# Altium project FPGA扩展板01.PrjPcb
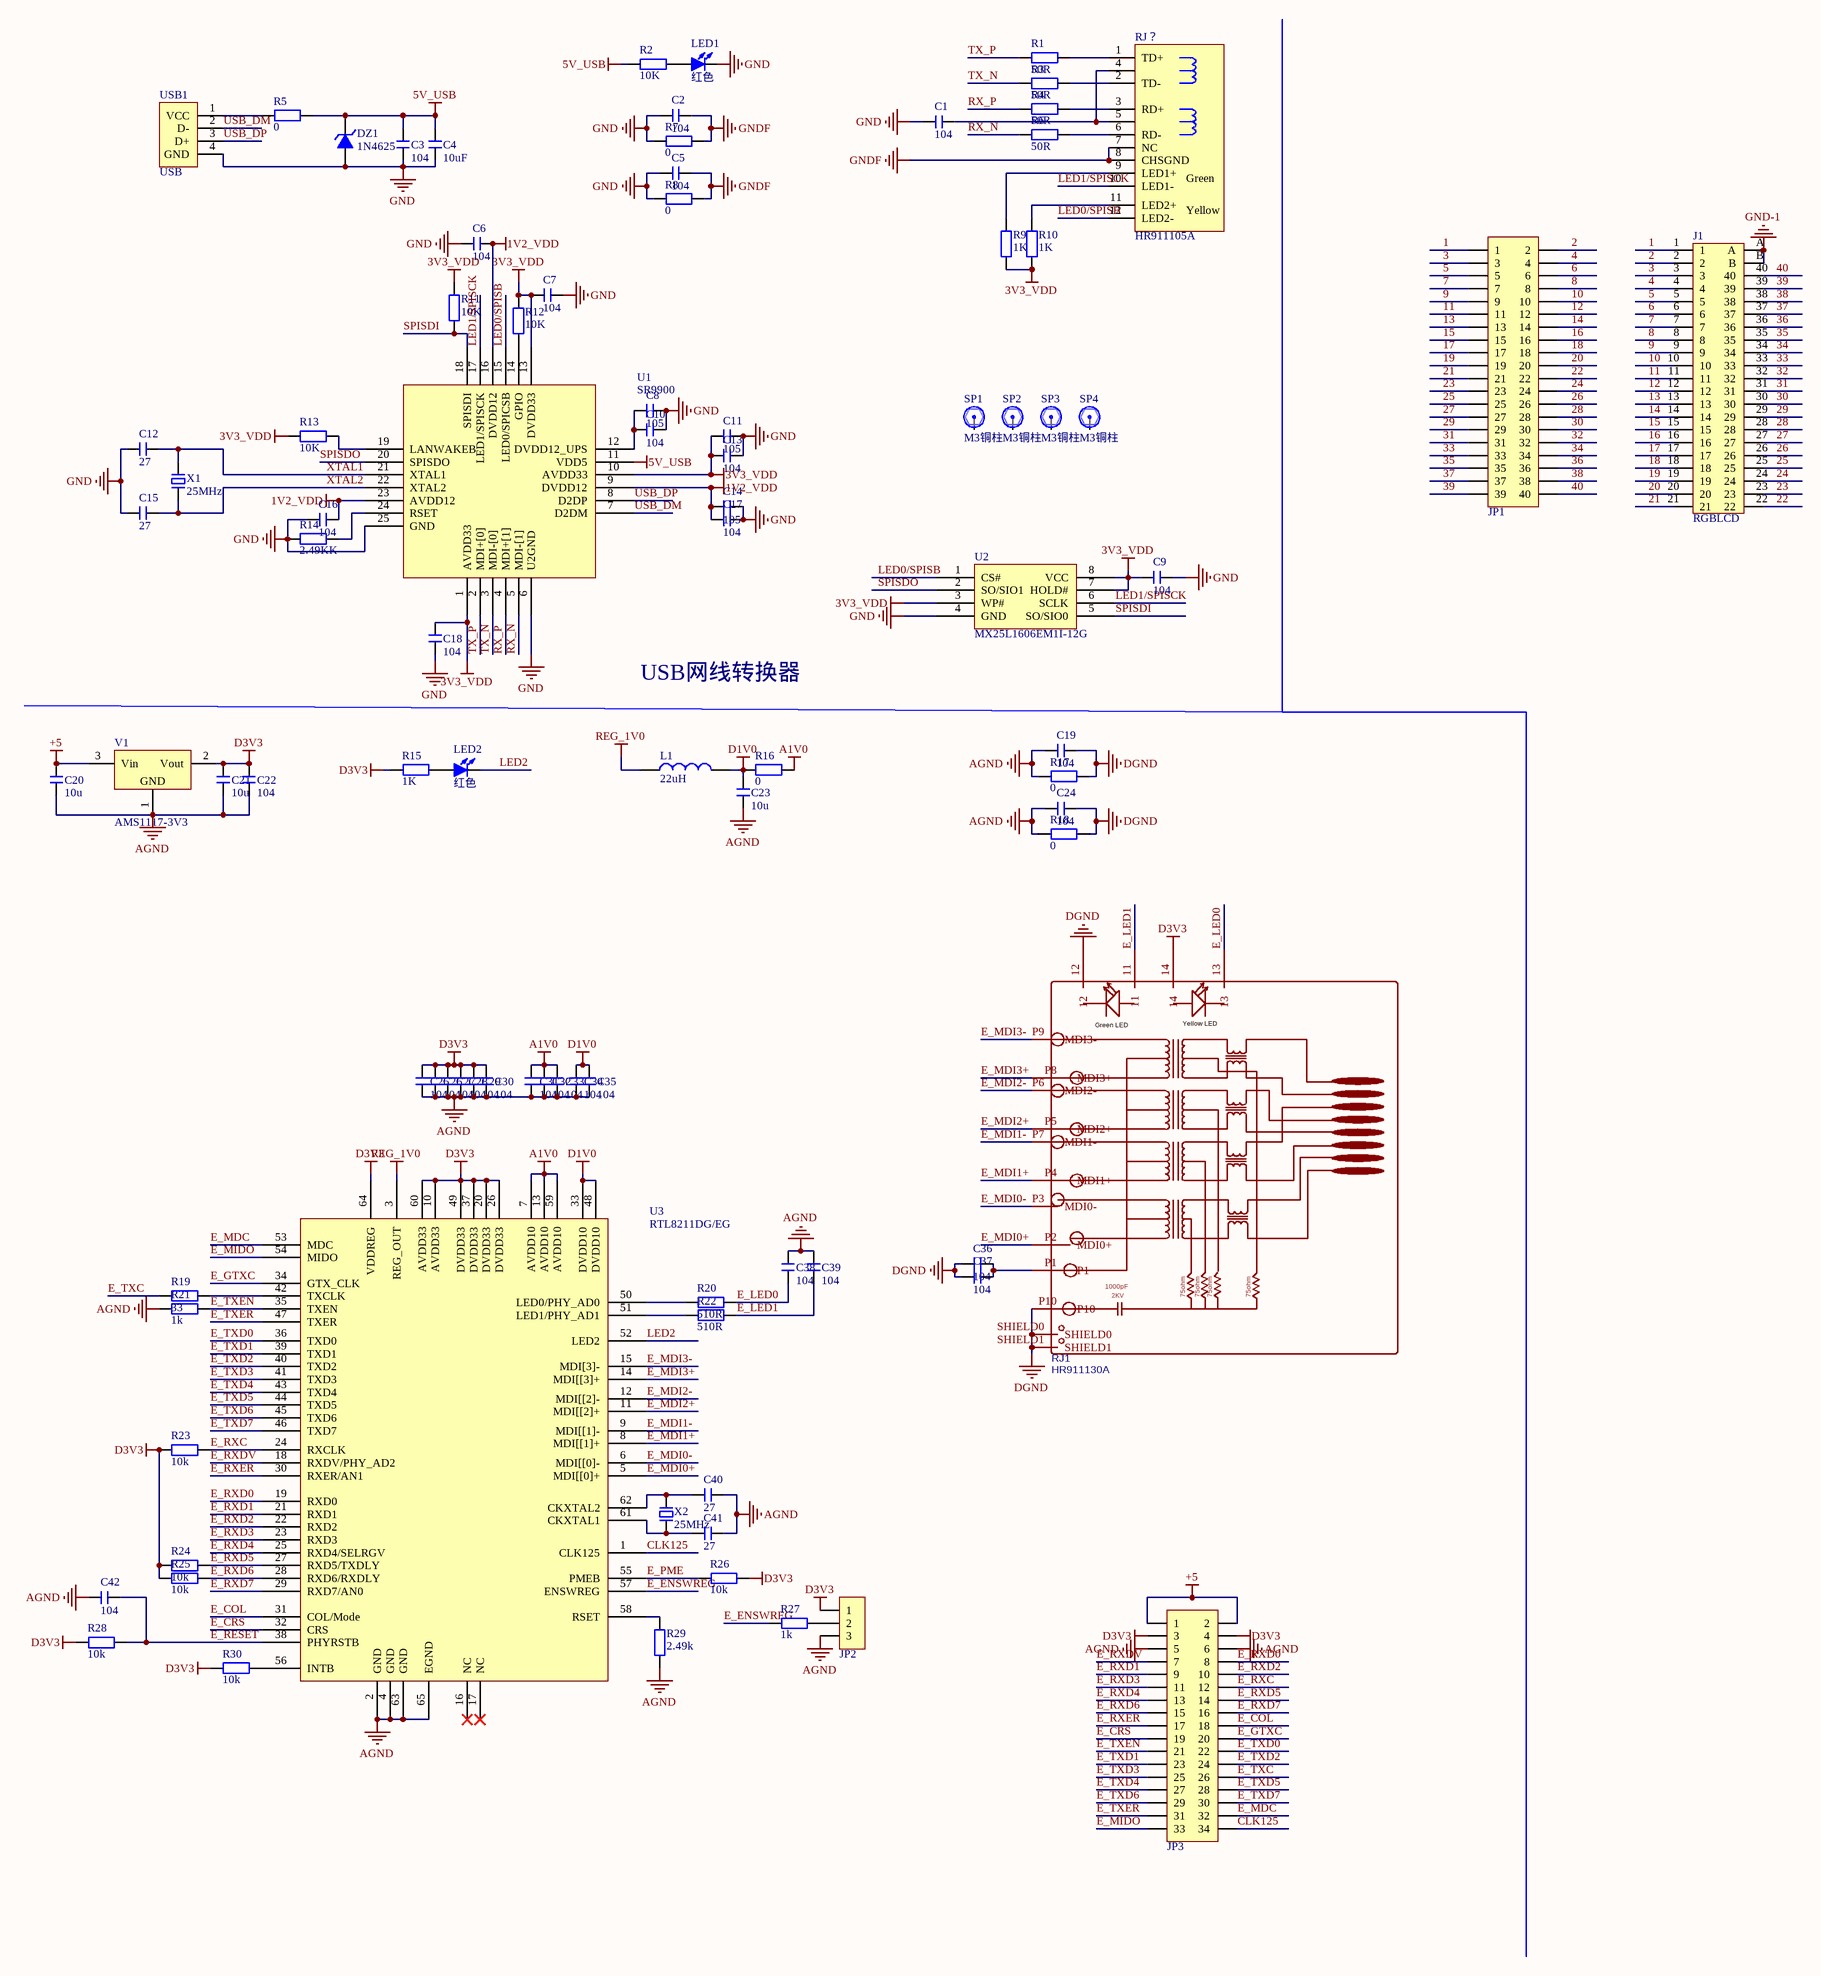
[diagram p0: FPGA扩展板01.SchDoc]
1 sheet, 93 parts. Net scope: global (net labels, ports and power ports of the same name join across sheets).
Board file: FPGA扩展板01.PcbDoc

## Sheet FPGA扩展板01.SchDoc
size A2

### Parts
C1  104  [C 0805_L]
C2  104  [C 0805_L]
C3  104  [C 0805_L]
C4  10uF  [C 0805_L]
C5  104  [C 0805_L]
C6  104  [C 0805_L]
C7  104  [C 0805_L]
C8  105  [C 0805_L]
C9  104  [C 0805_L]
C10  104  [C 0805_L]
C11  105  [C 0805_L]
C12  27  [C 0805_L]
C13  104  [C 0805_L]
C14  105  [C 0805_L]
C15  27  [C 0805_L]
C16  104  [C 0805_L]
C17  104  [C 0805_L]
C18  104  [C 0805_L]
C19  104  [C 0805_L]
C20  10u  [C 0805_L]
C21  10u  [C 0805_L]
C22  104  [C 0805_L]
C23  10u  [C 0805_L]
C24  104  [C 0805_L]
C25  104  [C 0805_L]
C26  104  [C 0805_L]
C27  104  [C 0805_L]
C28  104  [C 0805_L]
C29  104  [C 0805_L]
C30  104  [C 0805_L]
C31  104  [C 0805_L]
C32  104  [C 0805_L]
C33  104  [C 0805_L]
C34  104  [C 0805_L]
C35  104  [C 0805_L]
C36  104  [C 0805_L]
C37  104  [C 0805_L]
C38  104  [C 0805_L]
C39  104  [C 0805_L]
C40  27  [C 0805_L]
C41  27  [C 0805_L]
C42  104  [C 0805_L]
DZ1  1N4625  [DO-35]
J1  RGBLCD  [FPC-TOP40]
JP1  Header 2X11  [HDR2.54-LI-2x20P]  (value not drawn)
JP2  HDR-1X3  [HDR2.54-LI-3P]  (value not drawn)
JP3  Header 2X11  [HDR2.54-LI-2x17P]  (value not drawn)
L1  22uH  [L 0805]
LED1  红色  [LED 0805G]
LED2  红色  [LED 0805G]
R1  50R  [R 0805_L]
R2  10K  [R 0805_L]
R3  50R  [R 0805_L]
R4  50R  [R 0805_L]
R5  0  [R 0805_L]
R6  50R  [R 0805_L]
R7  0  [R 0805_L]
R8  0  [R 0805_L]
R9  1K  [R 0805_L]
R10  1K  [R 0805_L]
R11  10K  [R 0805_L]
R12  10K  [R 0805_L]
R13  10K  [R 0805_L]
R14  2.49KK  [R 0805_L]
R15  1K  [R 0805_L]
R16  0  [R 0805_L]
R17  0  [R 0805_L]
R18  0  [R 0805_L]
R19  33  [R 0805_L]
R20  510R  [R 0805_L]
R21  1k  [R 0805_L]
R22  510R  [R 0805_L]
R23  10k  [R 0805_L]
R24  10k  [R 0805_L]
R25  10k  [R 0805_L]
R26  10k  [R 0805_L]
R27  1k  [R 0805_L]
R28  10k  [R 0805_L]
R29  2.49k  [R 0805_L]
R30  10k  [R 0805_L]
RJ1  HR911130A  [RJ_45]
RJ？  HR911105A  [RJ-45A12]
SP1  M3铜柱  [M3x10+6_L]
SP2  M3铜柱  [M3x10+6_L]
SP3  M3铜柱  [M3x10+6_L]
SP4  M3铜柱  [M3x10+6_L]
U1  SR9900  [QFN24 4x4_M]
U2  MX25L1606EM1I-12G  [SOP8W_N]
U3  RTL8211DG/EG  [QFN65-050-0909]
USB1  USB  [USB_A/P_A]
V1  AMS1117-3V3  [SOT223_L]
X1  25MHz  [OSC HC-49S]
X2  25MHz  [OSC HC-49S]

### Nets
1V2_VDD: C6.2 C14.1 C16.2 C17.1 U1.9(DVDD12) U1.16(DVDD12) U1.23(AVDD12)
3V3_VDD: C7.1 C9.2 C11.1 C13.1 C18.1 R9.1 R10.1 R11.2 R12.2 R13.1 U1.1(AVDD33) U1.10(AVDD33) U1.13(DVDD33) U2.3(WP#) U2.7(HOLD#) U2.8(VCC)
5V_USB: C3.1 C4.1 DZ1.2(K) R2.1 R5.2 U1.11(VDD5)
+5: C20.2 JP3.1 JP3.2 V1.3(Vin)
A1V0: C31.2 C32.2 C33.2 R16.2 U3.7(AVDD10) U3.13(AVDD10) U3.59(AVDD10)
AGND: C19.1 C20.1 C21.1 C22.1 C23.1 C24.1 C25.1 C26.1 C27.1 C28.1 C29.1 C30.1 C31.1 C32.1 C33.1 C34.1 C35.1 C38.2 C39.2 C40.2 C41.2 C42.2 JP2.3 JP3.5 JP3.6 R17.1 R18.1 R21.1 R29.1 U3.2(GND) U3.4(GND) U3.63(GND) U3.65(EGND) V1.1(GND)
D1V0: C23.2 C34.2 C35.2 L1.2 R16.1 U3.33(DVDD10) U3.48(DVDD10)
D3V3: C21.2 C22.2 C25.2 C26.2 C27.2 C28.2 C29.2 C30.2 JP2.1 JP3.3 JP3.4 R15.1 R23.1 R24.1 R25.1 R26.1 R28.1 R30.1 RJ1.14 U3.10(AVDD33) U3.20(DVDD33) U3.26(DVDD33) U3.37(DVDD33) U3.49(DVDD33) U3.60(AVDD33) U3.64(VDDREG) V1.2(Vout)
DGND: C19.2 C24.2 C36.2 C37.2 R17.2 R18.2 RJ1.12 RJ1.P10 RJ1.SHIELD0 RJ1.SHIELD1
GND: C1.2 C2.1 C3.2 C4.2 C5.1 C6.1 C7.2 C8.2 C9.1 C10.2 C11.2 C12.1 C13.2 C14.2 C15.1 C16.1 C17.2 C18.2 DZ1.1(A) LED1.2(K) R7.1 R8.1 R14.2 U1.6(U2GND) U1.25(GND) U2.4(GND) USB1.4(GND)
GND-1: J1.A J1.B
GNDF: C2.2 C5.2 R7.2 R8.2 RJ？.7(NC) RJ？.8(CHSGND)
REG_1V0: L1.1 U3.3(REG_OUT)
1: J1.1 JP1.1
2: J1.2 JP1.2
3: J1.3 JP1.3
4: J1.4 JP1.4
5: J1.5 JP1.5
6: J1.6 JP1.6
7: J1.7 JP1.7
8: J1.8 JP1.8
9: J1.9 JP1.9
10: J1.10 JP1.10
11: J1.11 JP1.11
12: J1.12 JP1.12
13: J1.13 JP1.13
14: J1.14 JP1.14
15: J1.15 JP1.15
16: J1.16 JP1.16
17: J1.17 JP1.17
18: J1.18 JP1.18
19: J1.19 JP1.19
20: J1.20 JP1.20
21: J1.21 JP1.21
22: J1.22 JP1.22
23: J1.23 JP1.23
24: J1.24 JP1.24
25: J1.25 JP1.25
26: J1.26 JP1.26
27: J1.27 JP1.27
28: J1.28 JP1.28
29: J1.29 JP1.29
30: J1.30 JP1.30
31: J1.31 JP1.31
32: J1.32 JP1.32
33: J1.33 JP1.33
34: J1.34 JP1.34
35: J1.35 JP1.35
36: J1.36 JP1.36
37: J1.37 JP1.37
38: J1.38 JP1.38
39: J1.39 JP1.39
40: J1.40 JP1.40
CLK125: JP3.34 U3.1(CLK125)
E_COL: JP3.18 U3.31(COL/Mode)
E_CRS: JP3.19 U3.32(CRS)
E_ENSWREG: R27.2 U3.57(ENSWREG)
E_GTXC: JP3.20 U3.34(GTX_CLK)
E_LED0: C38.1 R20.2 RJ1.13
E_LED1: C39.1 R22.2 RJ1.11
E_MDC: JP3.32 U3.53(MDC)
E_MDI0+: RJ1.P2(MDI0+) U3.5(MDI[[0]+)
E_MDI0-: RJ1.P3(MDI0-) U3.6(MDI[[0]-)
E_MDI1+: RJ1.P4(MDI1+) U3.8(MDI[[1]+)
E_MDI1-: RJ1.P7(MDI1-) U3.9(MDI[[1]-)
E_MDI2+: RJ1.P5(MDI2+) U3.11(MDI[[2]+)
E_MDI2-: RJ1.P6(MDI2-) U3.12(MDI[[2]-)
E_MDI3+: RJ1.P8(MDI3+) U3.14(MDI[[3]+)
E_MDI3-: RJ1.P9(MDI3-) U3.15(MDI[3]-)
E_MIDO: JP3.33 U3.54(MIDO)
E_PME: R26.2 U3.55(PMEB)
E_RESET: C42.1 R28.2 U3.38(PHYRSTB)
E_RXC: JP3.12 R23.2 U3.24(RXCLK)
E_RXD0: JP3.8 U3.19(RXD0)
E_RXD1: JP3.9 U3.21(RXD1)
E_RXD2: JP3.10 U3.22(RXD2)
E_RXD3: JP3.11 U3.23(RXD3)
E_RXD4: JP3.13 U3.25(RXD4/SELRGV)
E_RXD5: JP3.14 R24.2 U3.27(RXD5/TXDLY)
E_RXD6: JP3.15 R25.2 U3.28(RXD6/RXDLY)
E_RXD7: JP3.16 U3.29(RXD7/AN0)
E_RXDV: JP3.7 U3.18(RXDV/PHY_AD2)
E_RXER: JP3.17 U3.30(RXER/AN1)
E_TXC: JP3.26 R19.1
E_TXD0: JP3.22 U3.36(TXD0)
E_TXD1: JP3.23 U3.39(TXD1)
E_TXD2: JP3.24 U3.40(TXD2)
E_TXD3: JP3.25 U3.41(TXD3)
E_TXD4: JP3.27 U3.43(TXD4)
E_TXD5: JP3.28 U3.44(TXD5)
E_TXD6: JP3.29 U3.45(TXD6)
E_TXD7: JP3.30 U3.46(TXD7)
E_TXEN: JP3.21 R21.2 U3.35(TXEN)
E_TXER: JP3.31 U3.47(TXER)
LED0/SPISB: RJ？.12(LED2-) U1.15(LED0/SPICSB) U2.1(CS#)
LED1/SPISCK: RJ？.10(LED1-) U1.17(LED1/SPISCK) U2.6(SCLK)
LED2: LED2.2(K) U3.52(LED2)
RX_N: R6.1 U1.5(MDI-[1])
RX_P: R4.1 U1.4(MDI+[1])
SPISDI: R11.1 U1.18(SPISDI) U2.5(SO/SIO0)
SPISDO: U1.20(SPISDO) U2.2(SO/SIO1)
TX_N: R3.1 U1.3(MDI-[0])
TX_P: R1.1 U1.2(MDI+[0])
USB_DM: U1.7(D2DM) USB1.2(D-)
USB_DP: U1.8(D2DP) USB1.3(D+)
XTAL1: C12.2 U1.21(XTAL1) X1.2
XTAL2: C15.2 U1.22(XTAL2) X1.1
NetC1_1: C1.1 RJ？.4 RJ？.5
NetC8_1: C8.1 C10.1 U1.12(DVDD12_UPS)
NetC36_1: C36.1 C37.1 RJ1.P1
NetC40_1: C40.1 U3.62(CKXTAL2) X2.2
NetC41_1: C41.1 U3.61(CKXTAL1) X2.1
NetJP2_2: JP2.2 R27.1
NetLED1_1: LED1.1(A) R2.2
NetLED2_1: LED2.1(A) R15.2
NetR1_2: R1.2 RJ？.1(TD+)
NetR3_2: R3.2 RJ？.2(TD-)
NetR4_2: R4.2 RJ？.3(RD+)
NetR5_1: R5.1 USB1.1(VCC)
NetR6_2: R6.2 RJ？.6(RD-)
NetR9_2: R9.2 RJ？.9(LED1+)
NetR10_2: R10.2 RJ？.11(LED2+)
NetR12_1: R12.1 U1.14(GPIO)
NetR13_2: R13.2 U1.19(LANWAKEB)
NetR14_1: R14.1 U1.24(RSET)
NetR19_2: R19.2 U3.42(TXCLK)
NetR20_1: R20.1 U3.50(LED0/PHY_AD0)
NetR22_1: R22.1 U3.51(LED1/PHY_AD1)
NetR29_2: R29.2 U3.58(RSET)
NetR30_2: R30.2 U3.56(INTB)

Not connected (* = marked no-connect by the designer): SP1 1; SP2 1; SP3 1; SP4 1; U3 16(NC)* 17(NC)*

### Notes on the sheet
- USB网线转换器
- (in symbol HR911105A) Green; Yellow
- (in symbol HR911130A) Yellow LED; Green LED; J8; J7; J6 RX-; J5; J4; J3 RX+; J2 TX-; J1 TX+; 1000pF; 75ohm; 2KV

### Library data of the parts
C1-C42 = C: 贴片电容; BOM名称: 无极性贴片电容; 淘宝ID: 封装库来自淘宝 ID：黄晶宝石; 联系售后: https://shop463601444.taobao.com
DZ1 = 1N4625: 5.1V/0.5W稳压管; 版权归属: 封装库来自淘宝 ID：黄晶宝石; BOM名称: 5.1V/0.5W稳压管; 学习资源: www.ooocke.com
J1 = FPC-40: FPC-40P-0.5mm
JP1 = Header 20X2: 20*2P接插件; 版权归属: 封装库来自淘宝 ID：黄晶宝石; BOM名称: 20*2P接插件; 学习资源: https://shop463601444.taobao.com
JP2 = Header 3: 3P接插件; 版权归属: 封装库来自淘宝 ID：黄晶宝石; BOM名称: 3P接插件; 学习资源: https://shop463601444.taobao.com
JP3 = Header 17X2: 17*2P接插件; 版权归属: 封装库来自淘宝 ID：黄晶宝石; BOM名称: 17*2P接插件; 学习资源: https://shop463601444.taobao.com
L1 = L: 小功率贴片电感; 淘宝ID: 封装库来自淘宝 ID：黄晶宝石; BOM名称: 小功率贴片电感; 联系售后: https://shop463601444.taobao.com
LED1 LED2 = LED-SMD: 贴片LED; 版权归属: 封装库来自淘宝 ID：黄晶宝石; BOM名称: 贴片LED; 学习资源: https://shop463601444.taobao.com
R1-R30 = R: 贴片电阻; 版权归属: 来自淘宝 ID：黄晶宝石; BOM名称: 贴片电阻; 联系售后: https://shop463601444.taobao.com
RJ1 = HR911130A: RJ_45网口; BOM_Manufacturer: HANRUN; BOM_Supplier: LCSC; BOM_Manufacturer Part: HR911130A; BOM_Supplier Part: C54408; spicePre: R; spiceSymbolName: HR911130A
RJ？ = HR911105A: 带灯以太网接口; 版权归属: 封装库来自淘宝 ID：黄晶宝石; BOM名称: 带灯以太网接口; 学习资源: https://shop463601444.taobao.com
SP1-SP4 = 铜柱加头小焊盘: 铜柱; 版权归属: 封装库来自淘宝 ID：黄晶宝石; BOM名称: 铜柱; 学习资源: https://shop463601444.taobao.com
USB1 = USB-A/P: USB-A型公接口; 版权归属: 源创客; BOM名称: USB-A型公接口; 学习资源: www.ooocke.com
V1 = AMS1117: 三端稳压芯片; BOM名称: 稳压芯片; 淘宝ID: 封装库来自淘宝 ID：黄晶宝石; 欢迎光临淘宝店铺: https://shop463601444.taobao.com
X1 X2 = XTAL-2P: 2脚无源脚晶振; 版权归属: 源创客; BOM名称: 2脚无源脚晶振; 学习资源: www.ooocke.com